# Altium project voice.PrjPCB
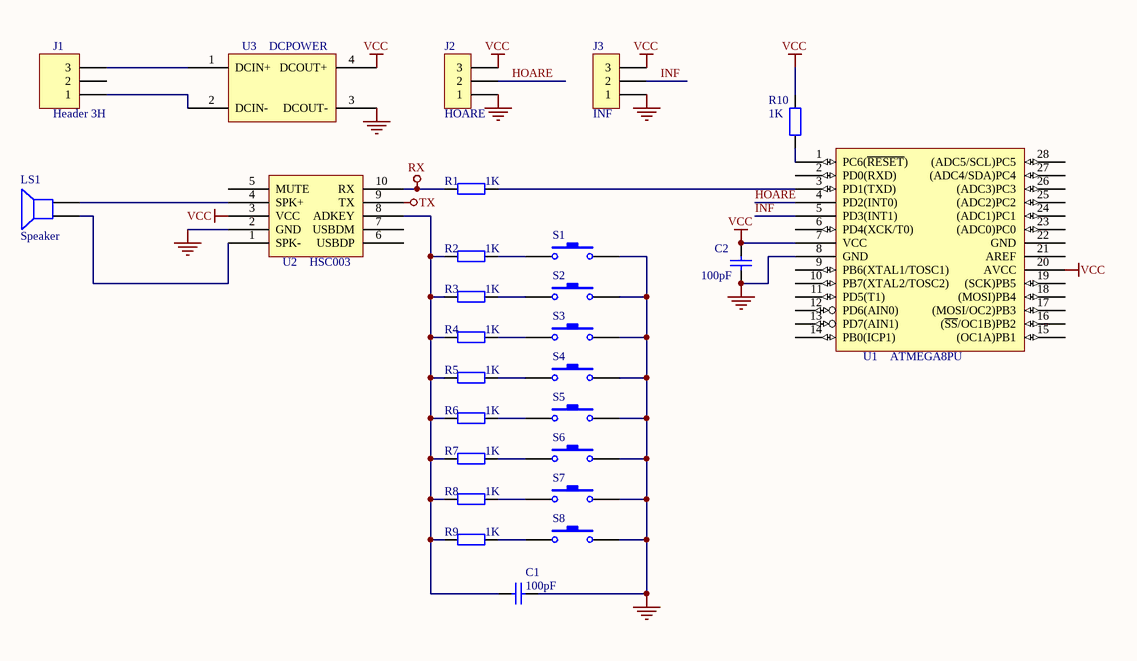
[diagram p0: VOICE.SchDoc]
1 sheet, 27 parts. Net scope: global (net labels, ports and power ports of the same name join across sheets).

## Sheet VOICE.SchDoc
size B; SheetNumber: 0; SheetTotal: 0; DrawnBy: 苏道桢; DocumentName: 语音报站器原理图

### Parts
C1  value 100pF  [RAD-0.3]  (hidden comment: CAP)
C2  value 100pF  [RAD-0.3]  (hidden comment: CAP)
J1  Header 3H  [HDR1X3H]
J2  HOARE
J3  INF
LS1  Speaker  [PIN2]
R1  value 1K  [AXIAL-0.4]  (hidden comment: RES2)
R2  value 1K  [AXIAL-0.4]  (hidden comment: RES2)
R3  value 1K  [AXIAL-0.4]  (hidden comment: RES2)
R4  value 1K  [AXIAL-0.4]  (hidden comment: RES2)
R5  value 1K  [AXIAL-0.4]  (hidden comment: RES2)
R6  value 1K  [AXIAL-0.4]  (hidden comment: RES2)
R7  value 1K  [AXIAL-0.4]  (hidden comment: RES2)
R8  value 1K  [AXIAL-0.4]  (hidden comment: RES2)
R9  value 1K  [AXIAL-0.4]  (hidden comment: RES2)
R10  value 1K  [AXIAL-0.4]  (hidden comment: RES2)
S1  SW-PB  [SPST-2]  (value not drawn)
S2  SW-PB  [SPST-2]  (value not drawn)
S3  SW-PB  [SPST-2]  (value not drawn)
S4  SW-PB  [SPST-2]  (value not drawn)
S5  SW-PB  [SPST-2]  (value not drawn)
S6  SW-PB  [SPST-2]  (value not drawn)
S7  SW-PB  [SPST-2]  (value not drawn)
S8  SW-PB  [SPST-2]  (value not drawn)
U1  ATMEGA8PU
U2  HSC003
U3  DCPOWER

### Nets
RX: R1.1 U2.10(RX)
TX: U2.9(TX)
VCC: C1.1 C2.1 C2.2 J2.1 J2.3 J3.1 J3.3 R10.2 S1.2 S2.2 S3.2 S4.2 S5.2 S6.2 S7.2 S8.2 U1.7(VCC) U1.8(GND) U1.20(AVCC) U2.2(GND) U2.3(VCC) U3.3(DCOUT-) U3.4(DCOUT+)
HOARE: J2.2 U1.4(PD2(INT0))
INF: J3.2 U1.5(PD3(INT1))
NetC1_2: C1.2 R2.1 R3.1 R4.1 R5.1 R6.1 R7.1 R8.1 R9.1 U2.8(ADKEY)
NetJ1_1: J1.1 U3.2(DCIN-)
NetJ1_3: J1.3 U3.1(DCIN+)
NetLS1_1: LS1.1 U2.1(SPK-)
NetLS1_2: LS1.2 U2.4(SPK+)
NetR1_2: R1.2 U1.3(PD1(TXD))
NetR2_2: R2.2 S1.1
NetR3_2: R3.2 S2.1
NetR4_2: R4.2 S3.1
NetR5_2: R5.2 S4.1
NetR6_2: R6.2 S5.1
NetR7_2: R7.2 S6.1
NetR8_2: R8.2 S7.1
NetR9_2: R9.2 S8.1
NetR10_1: R10.1 U1.1(PC6(~{RESET}))

Not connected (* = marked no-connect by the designer): J1 2; U1 2(PD0(RXD)) 6(PD4(XCK/T0)) 9(PB6(XTAL1/TOSC1)) 10(PB7(XTAL2/TOSC2)) 11(PD5(T1)) 12(PD6(AIN0)) 13(PD7(AIN1)) 14(PB0(ICP1)) 15((OC1A)PB1) 16((~{SS}/OC1B)PB2) 17((MOSI/OC2)PB3) 18((MOSI)PB4) 19((SCK)PB5) 21(AREF) 22(GND) 23((ADC0)PC0) 24((ADC1)PC1) 25((ADC2)PC2) 26((ADC3)PC3) 27((ADC4/SDA)PC4) 28((ADC5/SCL)PC5); U2 5(MUTE) 6(USBDP) 7(USBDM)

### Library data of the parts
C1 C2 = CAP: Capacitor; Published: 8-Jun-2000; LatestRevisionDate: 17-Jul-2002; LatestRevisionNote: Re-released for DXP Platform.; PackageReference: RAD-0.3; Publisher: Altium Limited
J1 = Header 3H: Header, 3-Pin, Right Angle; LatestRevisionDate: 17-Jul-2002; LatestRevisionNote: Re-released for DXP Platform.; Publisher: Altium Limited
J2 J3 = CON3: Connector
LS1 = SPEAKER: Loudspeaker; Published: 24-Mar-1999; LatestRevisionDate: 17-Jul-2002; LatestRevisionNote: Re-released for DXP Platform.; PackageReference: PIN2; Publisher: Altium Limited
R1-R10 = RES2: Resistor; Published: 8-Jun-2000; LatestRevisionDate: 17-Jul-2002; LatestRevisionNote: Re-released for DXP Platform.; PackageReference: AXIAL-0.4; Publisher: Altium Limited
S1-S8 = SW-PB: Switch; Published: 24-Mar-1999; LatestRevisionDate: 17-Jul-2002; LatestRevisionNote: Re-released for DXP Platform.; PackageReference: SPST-2; Publisher: Altium Limited